# EAGLE schematic ES_Daisy_Pod_Rev3 (EAGLE 9.6.1)

## Sheet 1 of 2
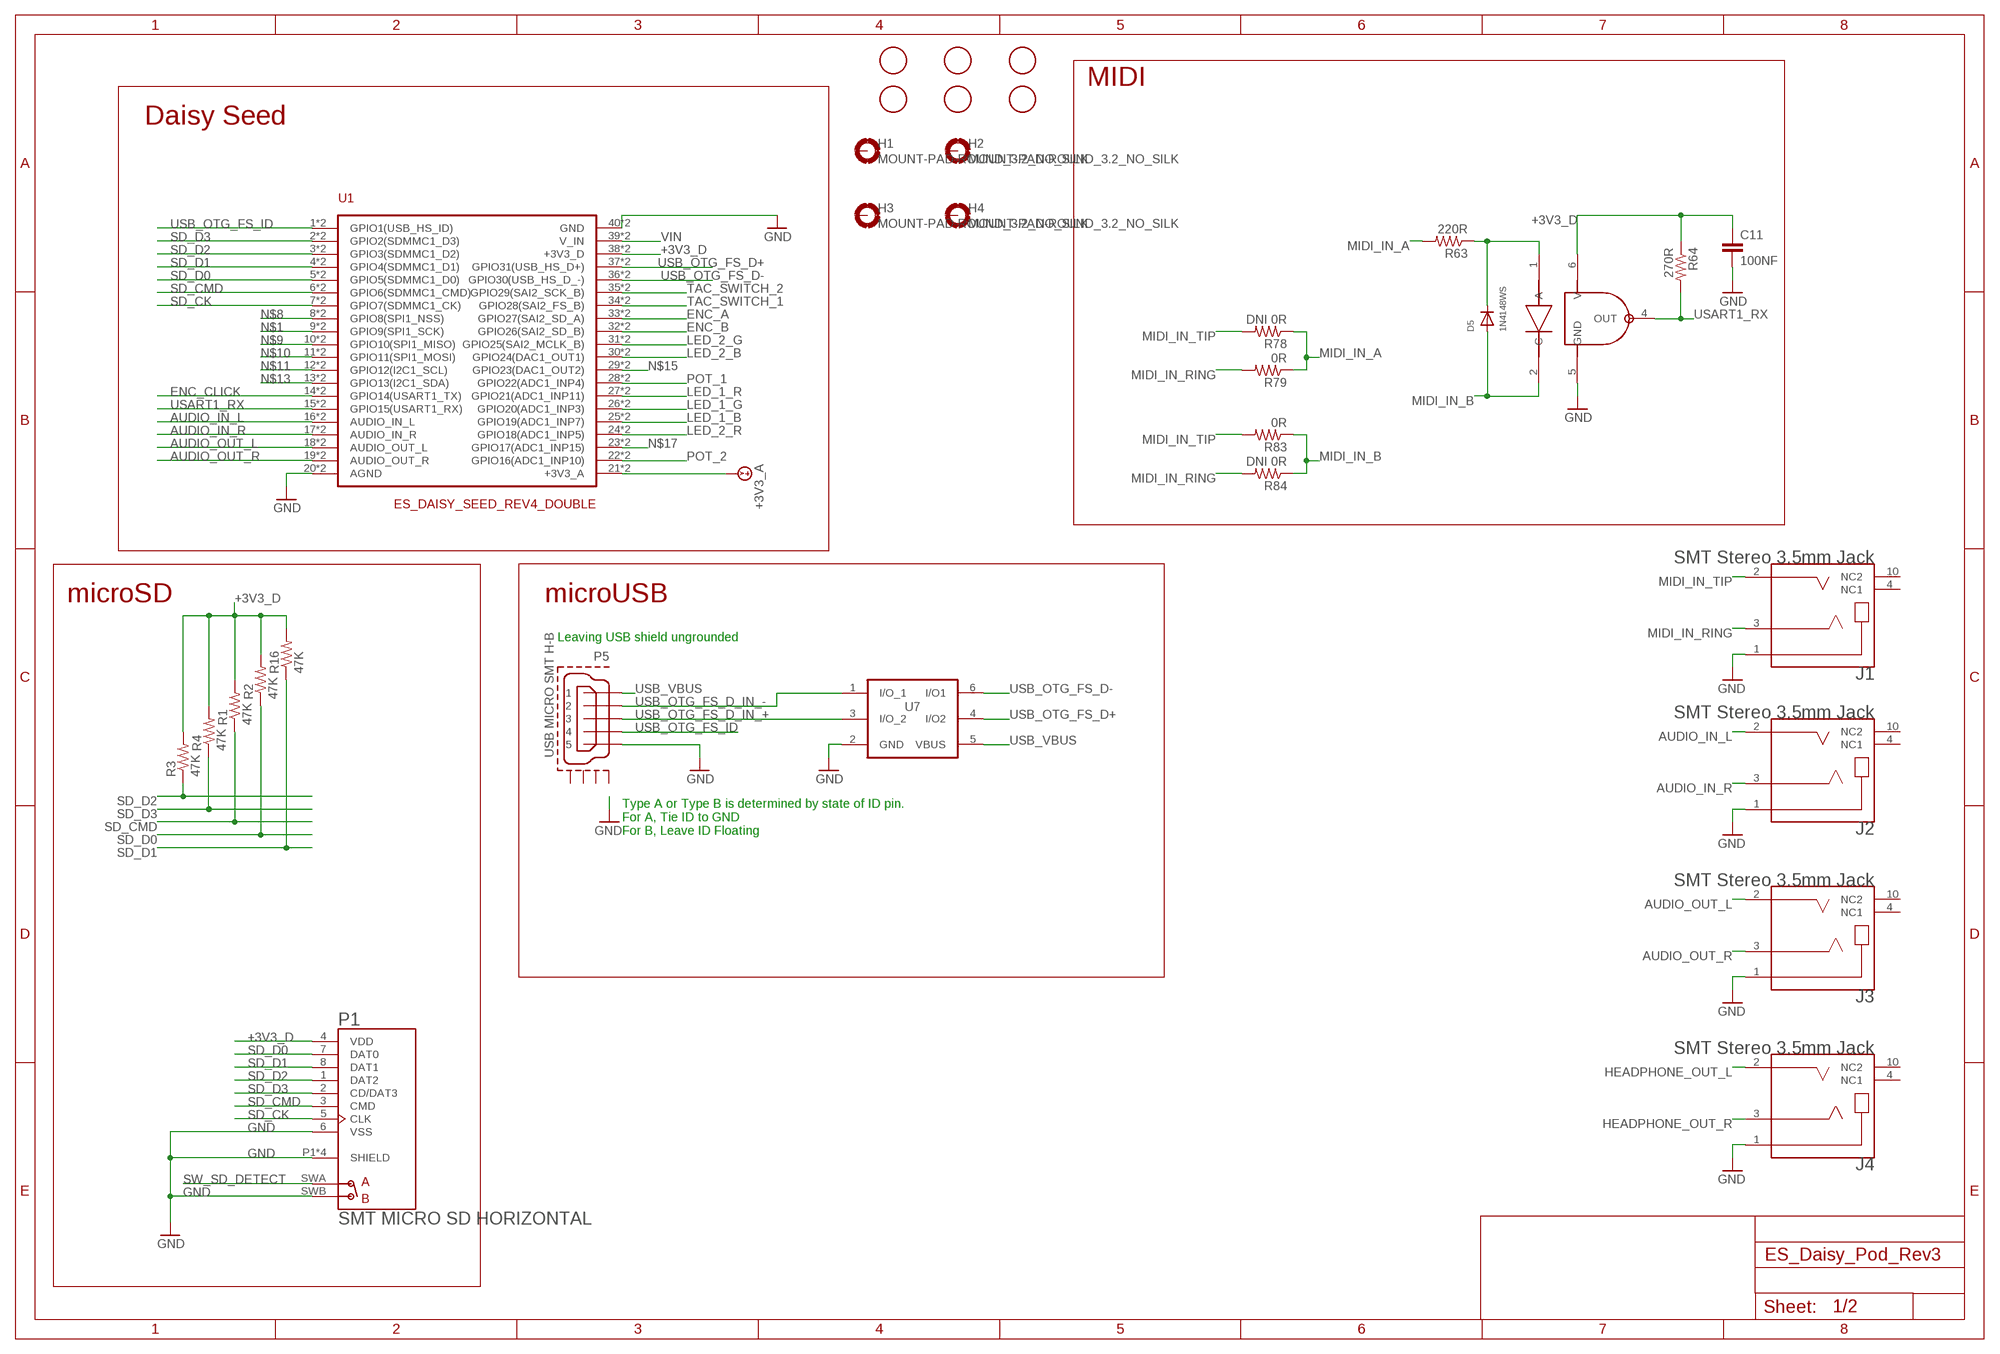
[diagram p0: schematic, sheet 1]

### Parts
C11  100NF  C-EUC0603  [C0603]
D5  1N4148WS  DIODE_SOD-323F  [SOD-323F]
FD1  FIDUCIAL  [FIDUCIAL_1MM]
FD2  FIDUCIAL  [FIDUCIAL_1MM]
FD3  FIDUCIAL  [FIDUCIAL_1MM]
FD4  FIDUCIAL  [FIDUCIAL_1MM]
FD5  FIDUCIAL  [FIDUCIAL_1MM]
FD6  FIDUCIAL  [FIDUCIAL_1MM]
H1  MOUNT-PAD-ROUND_3.2_NO_SILK  [32-PAD_NO_SILK]
H2  MOUNT-PAD-ROUND_3.2_NO_SILK  [32-PAD_NO_SILK]
H3  MOUNT-PAD-ROUND_3.2_NO_SILK  [32-PAD_NO_SILK]
H4  MOUNT-PAD-ROUND_3.2_NO_SILK  [32-PAD_NO_SILK]
J1  SMT Stereo 3.5mm Jack  SJ2_TRS_JACK  [CUI_SJ2-35863B1-SMT-TR]
J2  SMT Stereo 3.5mm Jack  SJ2_TRS_JACK  [CUI_SJ2-35863B1-SMT-TR]
J3  SMT Stereo 3.5mm Jack  SJ2_TRS_JACK  [CUI_SJ2-35863B1-SMT-TR]
J4  SMT Stereo 3.5mm Jack  SJ2_TRS_JACK  [CUI_SJ2-35863B1-SMT-TR]
P1  SMT MICRO SD HORIZONTAL  MICRO_SD_RIGHT_ANGLE  [HRS_DM3AT-SF-PEJM5]
P5  USB MICRO SMT H-B  USB_MICRO_AB_CUT  [47589-0001_CUT]
R1  47K  R-US_R0603  [R0603]
R2  47K  R-US_R0603  [R0603]
R3  47K  R-US_R0603  [R0603]
R4  47K  R-US_R0603  [R0603]
R16  47K  R-US_R0603  [R0603]
R63  220R  R-US_R0603  [R0603]
R64  270R  R-US_R0603  [R0603]
R78  DNI 0R  R-US_R0603  [R0603]
R79  0R  R-US_R0603  [R0603]
R83  0R  R-US_R0603  [R0603]
R84  DNI 0R  R-US_R0603  [R0603]
U1  ES_DAISY_SEED_REV4_DOUBLE  [ES_DAISY_SEED_DOUBLE]
U7  USBLC6 TVS SOT-23-6  USBLC6-2SC6  [SOT-23-6L]
U15  H11L1SR2M  OPTOISOLATOR_H11L1M  [DIL06_GULLWING]

### Nets
+3V3_A: U1.21(+3V3_A) U1.B21(+3V3_A) ; also sheet 2
+3V3_D: C11.1 P1.4(VDD) R1.2 R2.2 R3.2 R4.2 R16.2 R64.1 U1.38(+3V3_D) U1.B38(+3V3_D) U15.6(V) ; also sheet 2
AUDIO_IN_L: J2.2(TIP) U1.16(AUDIO_IN_L) U1.B16(AUDIO_IN_L)
AUDIO_IN_R: J2.3(RING) U1.17(AUDIO_IN_R) U1.B17(AUDIO_IN_R)
AUDIO_OUT_L: J3.2(TIP) U1.18(AUDIO_OUT_L) U1.B18(AUDIO_OUT_L) ; also sheet 2
AUDIO_OUT_R: J3.3(RING) U1.19(AUDIO_OUT_R) U1.B19(AUDIO_OUT_R) ; also sheet 2
ENC_A: U1.33(GPIO27(SAI2_SD_A)) U1.B33(GPIO27(SAI2_SD_A)) ; also sheet 2
ENC_B: U1.32(GPIO26(SAI2_SD_B)) U1.B32(GPIO26(SAI2_SD_B)) ; also sheet 2
ENC_CLICK: U1.14(GPIO14(USART1_TX)) U1.B14(GPIO14(USART1_TX)) ; also sheet 2
GND: C11.2 J1.1(SLEEVE) J2.1(SLEEVE) J3.1(SLEEVE) J4.1(SLEEVE) P1.6(VSS) P1.P1(SHIELD) P1.P2(SHIELD) P1.P3(SHIELD) P1.P4(SHIELD) P1.SWB(B) P5.5 U1.20(AGND) U1.40(GND) U1.B20(AGND) U1.B40(GND) U7.2(GND) U15.5(GND) ; also sheet 2
HEADPHONE_OUT_L [DATA]: J4.2(TIP) ; also sheet 2
HEADPHONE_OUT_R [DATA]: J4.3(RING) ; also sheet 2
LED_1_B: U1.25(GPIO19(ADC1_INP7)) U1.B25(GPIO19(ADC1_INP7)) ; also sheet 2
LED_1_G: U1.26(GPIO20(ADC1_INP3)) U1.B26(GPIO20(ADC1_INP3)) ; also sheet 2
LED_1_R: U1.27(GPIO21(ADC1_INP11)) U1.B27(GPIO21(ADC1_INP11)) ; also sheet 2
LED_2_B: U1.30(GPIO24(DAC1_OUT1)) U1.B30(GPIO24(DAC1_OUT1)) ; also sheet 2
LED_2_G: U1.31(GPIO25(SAI2_MCLK_B)) U1.B31(GPIO25(SAI2_MCLK_B)) ; also sheet 2
LED_2_R: U1.24(GPIO18(ADC1_INP5)) U1.B24(GPIO18(ADC1_INP5)) ; also sheet 2
MIDI_IN_A: R63.2 R78.1 R79.1
MIDI_IN_B: D5.A R83.1 R84.1 U15.2(C)
MIDI_IN_RING: J1.3(RING) R79.2 R84.2
MIDI_IN_TIP: J1.2(TIP) R78.2 R83.2
N$1: U1.9(GPIO9(SPI1_SCK)) U1.B9(GPIO9(SPI1_SCK))
N$8: U1.8(GPIO8(SPI1_NSS)) U1.B8(GPIO8(SPI1_NSS))
N$9: U1.10(GPIO10(SPI1_MISO)) U1.B10(GPIO10(SPI1_MISO))
N$10: U1.11(GPIO11(SPI1_MOSI)) U1.B11(GPIO11(SPI1_MOSI))
N$11: U1.12(GPIO12(I2C1_SCL)) U1.B12(GPIO12(I2C1_SCL))
N$13: U1.13(GPIO13(I2C1_SDA)) U1.B13(GPIO13(I2C1_SDA))
N$15: U1.29(GPIO23(DAC1_OUT2)) U1.B29(GPIO23(DAC1_OUT2))
N$17: U1.23(GPIO17(ADC1_INP15)) U1.B23(GPIO17(ADC1_INP15))
N$77: D5.C R63.1 U15.1(A)
POT_1: U1.28(GPIO22(ADC1_INP4)) U1.B28(GPIO22(ADC1_INP4)) ; also sheet 2
POT_2: U1.22(GPIO16(ADC1_INP10)) U1.B22(GPIO16(ADC1_INP10)) ; also sheet 2
SD_CK: P1.5(CLK) U1.7(GPIO7(SDMMC1_CK)) U1.B7(GPIO7(SDMMC1_CK))
SD_CMD: P1.3(CMD) R1.1 U1.6(GPIO6(SDMMC1_CMD)) U1.B6(GPIO6(SDMMC1_CMD))
SD_D0: P1.7(DAT0) R2.1 U1.5(GPIO5(SDMMC1_D0)) U1.B5(GPIO5(SDMMC1_D0))
SD_D1: P1.8(DAT1) R16.1 U1.4(GPIO4(SDMMC1_D1)) U1.B4(GPIO4(SDMMC1_D1))
SD_D2: P1.1(DAT2) R3.1 U1.3(GPIO3(SDMMC1_D2)) U1.B3(GPIO3(SDMMC1_D2))
SD_D3: P1.2(CD/DAT3) R4.1 U1.2(GPIO2(SDMMC1_D3)) U1.B2(GPIO2(SDMMC1_D3))
SW_SD_DETECT: P1.SWA(A)
TAC_SWITCH_1: U1.34(GPIO28(SAI2_FS_B)) U1.B34(GPIO28(SAI2_FS_B)) ; also sheet 2
TAC_SWITCH_2: U1.35(GPIO29(SAI2_SCK_B)) U1.B35(GPIO29(SAI2_SCK_B)) ; also sheet 2
USART1_RX: R64.2 U1.15(GPIO15(USART1_RX)) U1.B15(GPIO15(USART1_RX)) U15.4(OUT)
USB_OTG_FS_D+: U1.37(GPIO31(USB_HS_D+)) U1.B37(GPIO31(USB_HS_D+)) U7.4(I/O2)
USB_OTG_FS_D-: U1.36(GPIO30(USB_HS_D_-)) U1.B36(GPIO30(USB_HS_D_-)) U7.6(I/O1)
USB_OTG_FS_D_IN_+ [DATA]: P5.3 U7.3(I/O_2)
USB_OTG_FS_D_IN_- [DATA]: P5.2 U7.1(I/O_1)
USB_OTG_FS_ID: P5.4 U1.1(GPIO1(USB_HS_ID)) U1.B1(GPIO1(USB_HS_ID))
USB_VBUS: P5.1 U7.5(VBUS)
VIN: U1.39(V_IN) U1.B39(V_IN)
Unconnected: H1.B3,2(MOUNT) H2.B3,2(MOUNT) H3.B3,2(MOUNT) H4.B3,2(MOUNT) J1.4(NC1) J1.10(NC2) J2.4(NC1) J2.10(NC2) J3.4(NC1) J3.10(NC2) J4.4(NC1) J4.10(NC2) P5.CASING1(GND1) P5.CASING2(GND2) P5.CASING3(GND3) P5.CASING4(GND4)

### Notes on the sheet
- MIDI
- Daisy Seed
- microSD | microUSB
- Leaving USB shield ungrounded
- Type A or Type B is determined by state of ID pin.
  For A, Tie ID to GND
  For B, Leave ID Floating

## Sheet 2 of 2
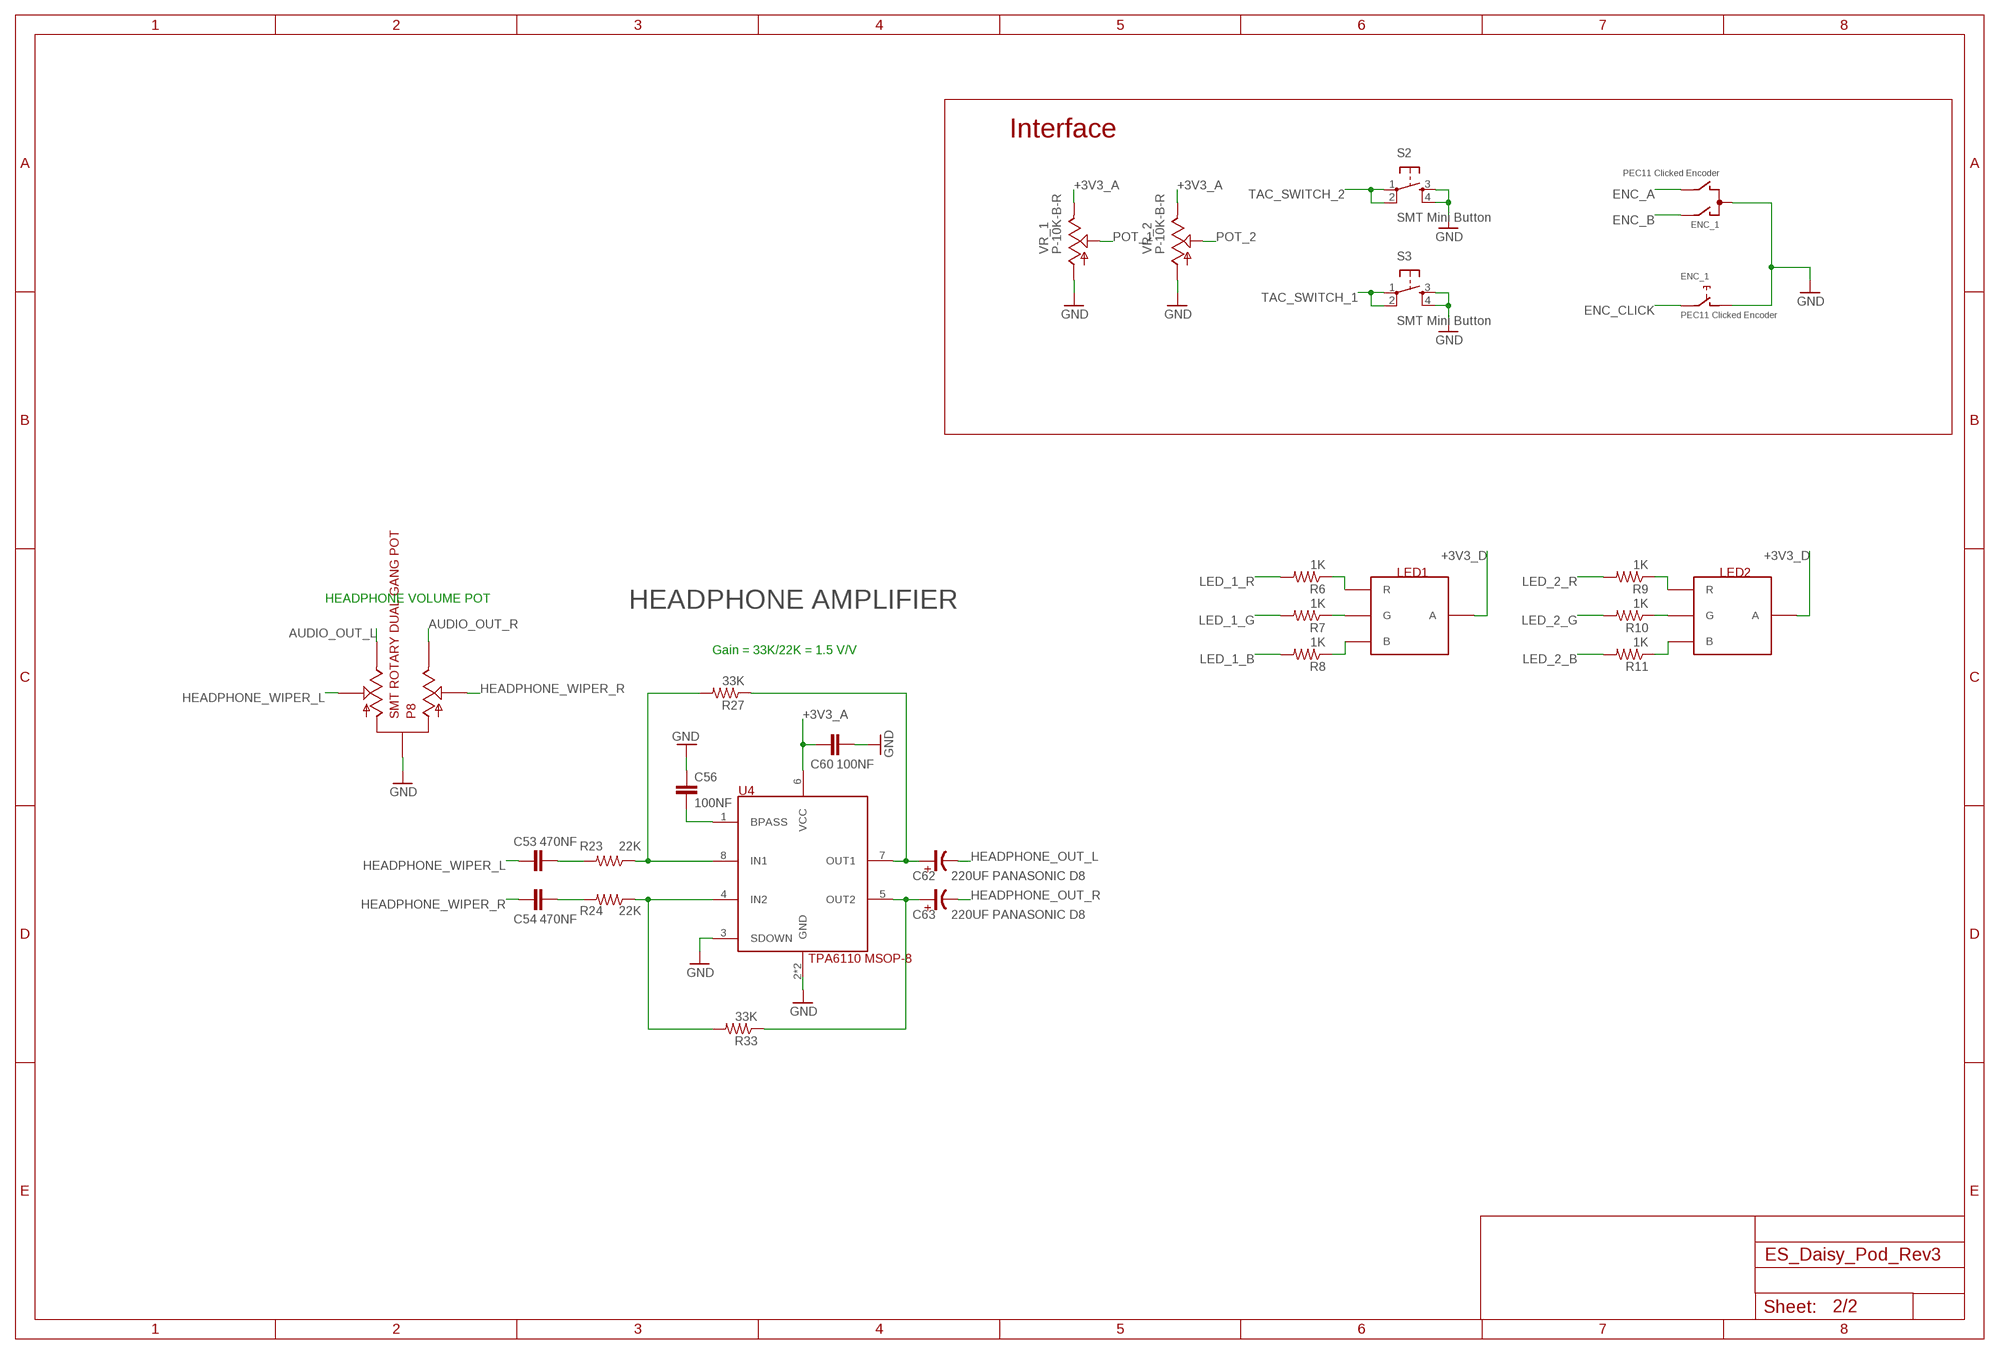
[diagram p1: schematic, sheet 2]

### Parts
C53  470NF  C-EUC0603  [C0603]
C54  470NF  C-EUC0603  [C0603]
C56  100NF  C-EUC0603  [C0603]
C60  100NF  C-EUC0603  [C0603]
C62  220UF PANASONIC D8  C-EU-POL_D  [PANASONIC_D]
C63  220UF PANASONIC D8  C-EU-POL_D  [PANASONIC_D]
ENC_1  PEC11 Clicked Encoder  ENCODER_CLICK_SILK  [PEC11_SILK]
LED1  RGB LED SMT PLCC4  LED_RGB_SMT  [P-LCC-4-3]
LED2  RGB LED SMT PLCC4  LED_RGB_SMT  [P-LCC-4-3]
P8  SMT ROTARY DUAL GANG POT  ROTARY_POT  [RK10J12R0A0B]
R6  1K  R-US_R0603  [R0603]
R7  1K  R-US_R0603  [R0603]
R8  1K  R-US_R0603  [R0603]
R9  1K  R-US_R0603  [R0603]
R10  1K  R-US_R0603  [R0603]
R11  1K  R-US_R0603  [R0603]
R23  22K  R-US_R0603  [R0603]
R24  22K  R-US_R0603  [R0603]
R27  33K  R-US_R0603  [R0603]
R33  33K  R-US_R0603  [R0603]
S2  SMT Mini Button  TAC_SWITCH_SMT  [TL3301SPF160QJ]
S3  SMT Mini Button  TAC_SWITCH_SMT  [TL3301SPF160QJ]
U4  TPA6110 MSOP-8  TPA6110MSOP  [MSOP_8_PWRPAD]
VR_1  P-10K-B-R  POT_9MM_SNAP-IN__  [9MM_SNAP-IN_POT_SILK]
VR_2  P-10K-B-R  POT_9MM_SNAP-IN__  [9MM_SNAP-IN_POT_SILK]

### Nets
+3V3_A: C60.2 U4.6(VCC) VR_1.3 VR_2.3 ; also sheet 1
+3V3_D: LED1.2(A) LED2.2(A) ; also sheet 1
AUDIO_OUT_L: P8.P$5 ; also sheet 1
AUDIO_OUT_R: P8.P$4 ; also sheet 1
ENC_A: ENC_1.B ; also sheet 1
ENC_B: ENC_1.A ; also sheet 1
ENC_CLICK: ENC_1.E ; also sheet 1
GND: C56.1 C60.1 ENC_1.C ENC_1.D P8.P$1 S2.3 S2.4 S3.3 S3.4 U4.2(GND) U4.3(SDOWN) U4.9(GND) VR_1.1 VR_2.1 ; also sheet 1
HEADPHONE_OUT_L [DATA]: C62.-(NEG) ; also sheet 1
HEADPHONE_OUT_R [DATA]: C63.-(NEG) ; also sheet 1
HEADPHONE_WIPER_L [DATA]: C53.1 P8.P$2
HEADPHONE_WIPER_R [DATA]: C54.1 P8.P$3
LED_1_B: R8.2 ; also sheet 1
LED_1_G: R7.2 ; also sheet 1
LED_1_R: R6.2 ; also sheet 1
LED_2_B: R11.2 ; also sheet 1
LED_2_G: R10.2 ; also sheet 1
LED_2_R: R9.2 ; also sheet 1
N$2: LED1.1(R) R6.1
N$3: LED1.4(G) R7.1
N$4: LED1.3(B) R8.1
N$5: LED2.1(R) R9.1
N$6: LED2.4(G) R10.1
N$7: LED2.3(B) R11.1
N$12 [DATA]: C54.2 R24.2
N$19 [DATA]: R23.1 R27.2 U4.8(IN1)
N$20 [DATA]: R24.1 R33.2 U4.4(IN2)
N$34 [DATA]: C53.2 R23.2
N$39 [DATA]: C56.2 U4.1(BPASS)
N$40 [DATA]: C62.+(POS) R27.1 U4.7(OUT1)
N$41 [DATA]: C63.+(POS) R33.1 U4.5(OUT2)
POT_1: VR_1.2 ; also sheet 1
POT_2: VR_2.2 ; also sheet 1
TAC_SWITCH_1: S3.1 S3.2 ; also sheet 1
TAC_SWITCH_2: S2.1 S2.2 ; also sheet 1
Unconnected: ENC_1.GND1(G) ENC_1.GND2(G)

### Notes on the sheet
- Interface
- HEADPHONE VOLUME POT
- HEADPHONE AMPLIFIER
- Gain = 33K/22K = 1.5 V/V

## Library data of the parts
C11 C53 C54 C56 C60 = Electrosmith-Passives:C-EU: CAPACITOR, European symbol; PACKAGE: C0603
C62 C63 = Electrosmith-Passives:C-EU-POL
D5 = Electrosmith-Semiconductors:DIODE: Diode SMADIODE - SMA Surface Mount Package 20V 1A Schottky Diode Digikey: 641-1014-6-ND DO-1N4148 - Through Hole Small Current Diode SOD-123 20V 1 A (.5mV Vf) Schottky Diode - Digikey: MBRX120TPMSCT-ND SOD-323 10V 570mA (.38mV Vf, 3ns) Schottky Diode - Digikey: ZLLS410CT-ND SOD-523 30V 30mA Schottky Diode (RB751S-40TE61) - Digikey: RB751S-40TE61CT-ND SOT23-R/W - SOT23 Package (R = Solder Paste/Reflow Ovens, W = Hand-Soldering) BAT54Film 40V 300mA - Digikey: 497-7162-1-ND; PACKAGE: SOD-323
ENC_1 = Electrosmith-Interface:ENCODER: ALPS rotary Encoder EC12E series with switch
FD1-FD6 = Electrosmith-Connectors:FIDUCIAL: For use by pick and place machines to calibrate the vision/machine, 1mm By microbuilder.eu
H1-H4 = Electrosmith-Connectors:MOUNT-PAD-ROUND: MOUNTING PAD, round
J1-J4 = Electrosmith-Connectors:SJ2_TRS_JACK: 3 conductors, 3.5mm, SMT Audio Jack w/ Tip Switch; AVAILABILITY: Unavailable; CUI_PURCHASE_URL: https://www.cui.com/product/interconnect/audio-connectors/jacks/3.5-mm-jacks/sj2-3586x-smt-series?utm_source=snapeda.com&utm_medium=referral&utm_campaign=snapedaBOM; DESCRIPTION: 3 conductors, 3.5mm, SMT Audio Jack w/ Tip Switch; MF: CUI Inc.; MP: SJ2-35863B1-SMT-TR; PACKAGE: None; PRICE: None
LED1 LED2 = Electrosmith-Interface:LED_RGB_SMT; BIN#: 8-001; IPN: RGB LED SMT PLCC4; MPN: CLVBA-FKA-CC1F1L1BB7R3R3; PACKAGE: PLCC4
P1 = Electrosmith-Connectors:MICRO_SD_RIGHT_ANGLE: DM3 Series 8 Position Right Angle SMT Push Push Ejection MicroSD Card Connector; AVAILABILITY: Unavailable; DESCRIPTION: DM3 RA SMT microSD memory card push/push; MF: Hirose; MP: DM3AT-SF-PEJM5; PACKAGE: None; PRICE: None
P5 = Electrosmith-Connectors:USB_MICRO_AB
P8 = Electrosmith-Interface:ROTARY_POT
R1-R4 R6-R11 R16 R23 R24 R27 R33 R63 R64 R78 R79 R83 R84 = Electrosmith-Passives:R-US_: RESISTOR, American symbol; PACKAGE: R0603
S2 S3 = Electrosmith-Interface:TAC_SWITCH_SMT: Momentary Switch Button commonly used for reset or general input. Spark Fun Electronics SKU : COM-00097; BIN#: 24-010; IPN: SMT Mini Button; MPN: TL3301SPF160QJ
U1 = Electrosmith-Boards:ES_DAISY_SEED_REV4
U4 = Electrosmith-IC:TPA6110
U7 = Electrosmith-Semiconductors:USBLC6-2: VERY LOW CAPACITANCE ESD PROTECTION 2 line Datasheet link <http://www.st.com/web/catalog/sense_power/FM114/CL1137/SC1489/PF93353>; IPN: USBLC6-2SC6; MPN: USBLC6-2SC6
U15 = Electrosmith-IC:OPTOISOLATOR_H11L1M; MPN: H11L1SR2M
VR_1 VR_2 = Electrosmith-Interface:POT_9MM_SNAP-IN_: 9mm vertical snap-in pot, Alpha / Panasonic style

## Net classes
0 DEFAULT: width 0.102 mm, drill 0.2 mm, clearance 0.102 mm
1 POWER: width 0.102 mm, drill 0.2 mm, clearance 0.102 mm